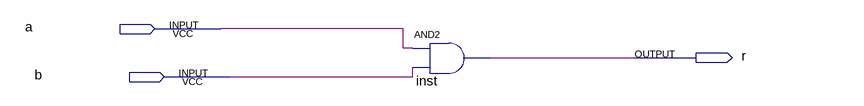
[diagram p0: schematic sheet]
// Quartus schematic and.bdf as structural Verilog: 1 symbols, 3 pins
module \and  (
  input  a,
  input  b,
  output r
);

  and inst (r, a, b);
endmodule
